# EAGLE design circuito_distanciamento_social (EAGLE 9.6.1)
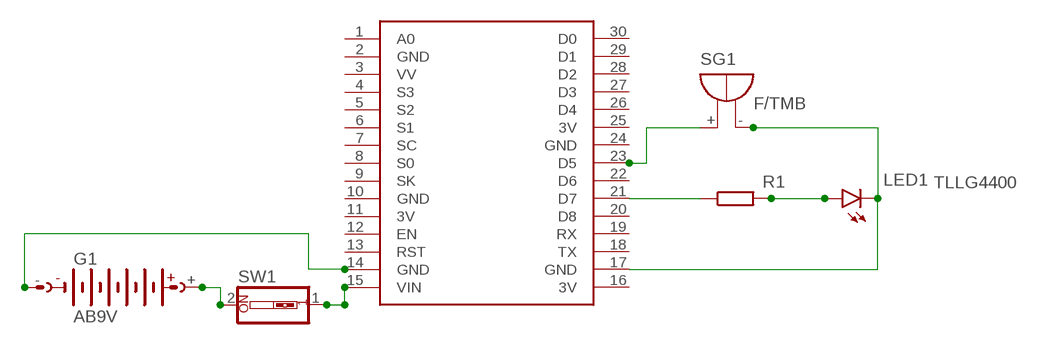
[diagram p0: schematic, sheet 1]

## Parts
G1  AB9V  [AB9V]
LED1  TLLG4400  [LED3MM]
R1  R-EU_0207/10  [0207/10]
SG1  F/TMB  [F/TMB]
SW1  SW_DIP-1  [EDG-01]
U$1  NODEMCU  [NODEMCU]

## Nets
N$1: R1.1 U$1.21(D7)
N$2: LED1.K(C) SG1.- U$1.17(GND)
N$4: SG1.+ U$1.23(D5)
N$9: LED1.A R1.2
N$15: G1.+ SW1.2
N$17: G1.- U$1.14(GND)
N$18: SW1.1 U$1.15(VIN)
Unconnected: U$1.1(A0) U$1.3(VV) U$1.4(S3) U$1.5(S2) U$1.6(S1) U$1.7(SC) U$1.8(S0) U$1.9(SK) U$1.12(EN) U$1.13(RST) U$1.18(TX) U$1.19(RX) U$1.20(D8) U$1.22(D6) U$1.26(D4) U$1.27(D3) U$1.28(D2) U$1.29(D1) U$1.30(D0)

## Power pins joined to a net without a drawn wire
3V: U$1.11(3V) U$1.16(3V) U$1.25(3V)
GND: U$1.2(GND) U$1.10(GND) U$1.24(GND)

## Library data of the parts
G1 = battery:AB9V: 9-V BATTERY CLIP
LED1 = led:TLLG4400: Low Current (2mA) LED 3 mm Tinted Diffused Package color GREEN Source: Data sheet <http://www.farnell.com/datasheets/391098.pdf>; MF: VISHAY SEMICONDUCTOR; OC_FARNELL: 1612435
R1 = rcl:R-EU_: RESISTOR, European symbol; SPICEPREFIX: R
SG1 = buzzer:F/TMB: BUZZER Source: Buerklin; OC_FARNELL: unknown; OC_NEWARK: unknown
SW1 = special:SW_DIP-1: DIP SWITCH
U$1 = nodemcu:NODEMCU

## Board
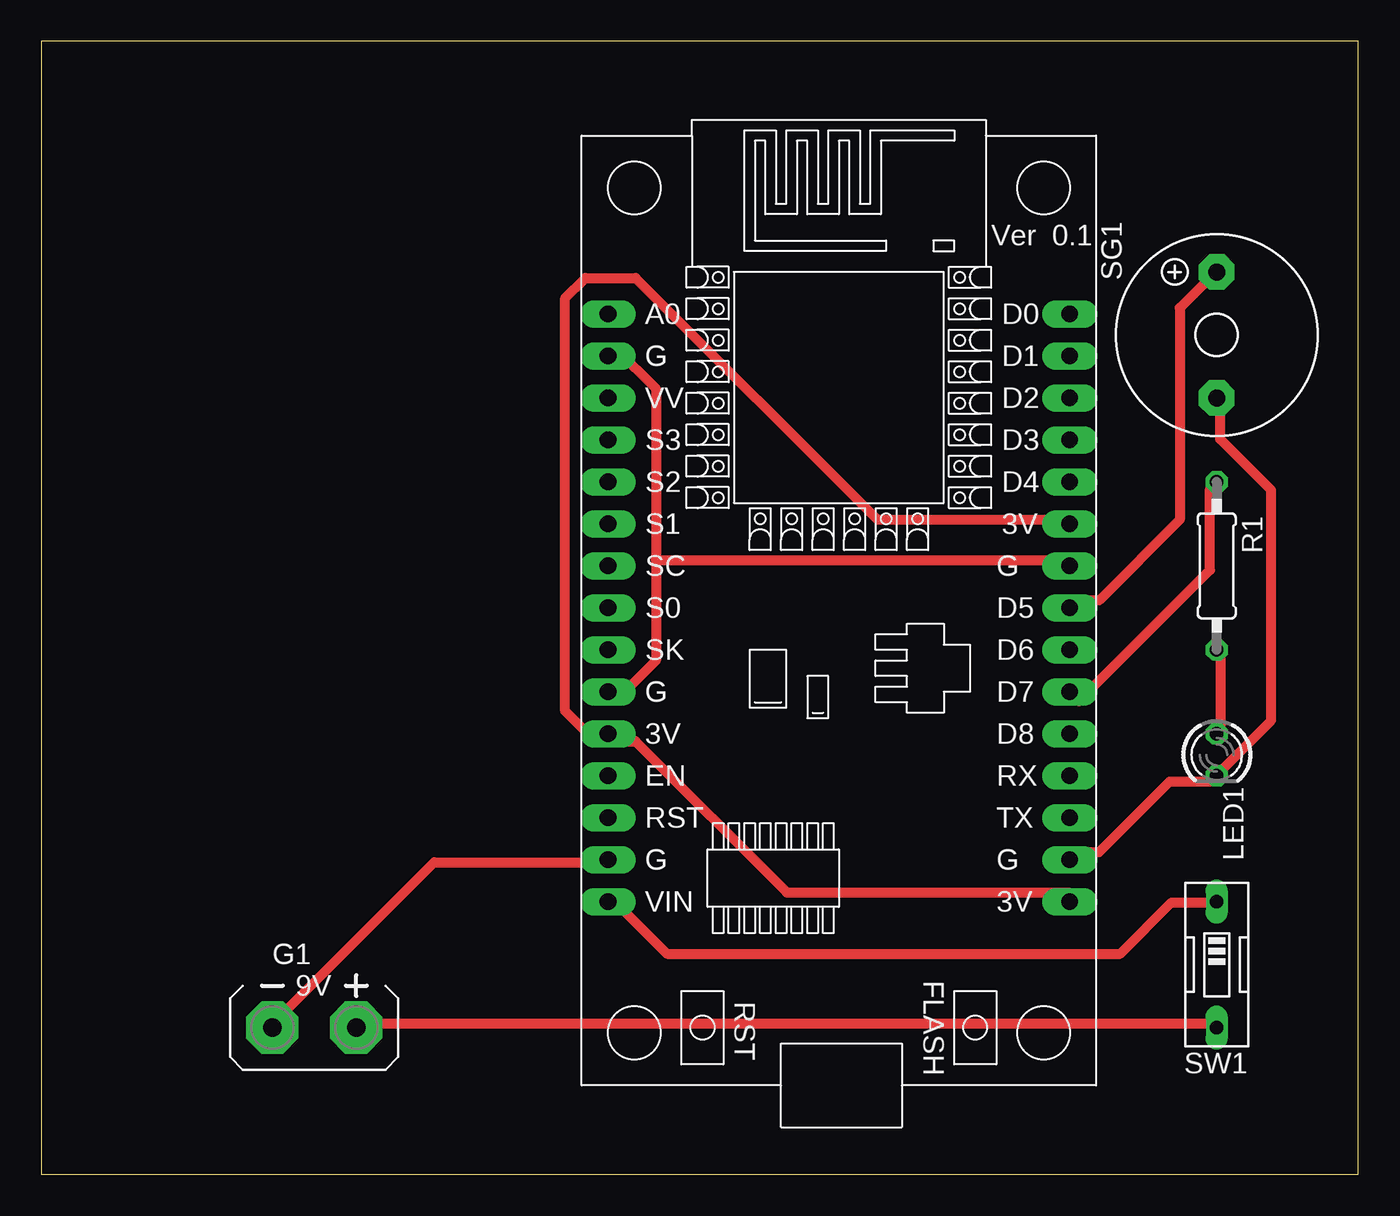
[diagram p1: board, top side]

Size 79.68 x 68.57 mm. Coordinates in mm from the lower left corner, seen from the top.
Outline: 0,0 79.68,0 79.68,68.57 0,68.57 0,0
Copper layers (1*16): Top 0.035mm / dielectric 1.5mm / Bottom 0.035mm
Design rules "default *": minimum track width 24mil, minimum drill 0.35mm, track to track 24mil, track to pad 24mil, pad to pad 24mil, via to via 24mil, smd to smd 6mil, copper to edge 40mil, drill to drill 24mil, minimum pad ring 10mil, minimum via ring 8mil, stop-mask expansion 4mil, vias tented up to drill 0mil, thermal gap 10mil

### Footprints (pad centres in the part's own frame; a part is rotated, then mirrored left to right if it is on the bottom)
AB9V = drill 1.118 pad 3.15 octagon: + 0,2.54; - 0,-2.54
LED3MM = drill 0.813 octagon: A -1.27,0; K 1.27,0
0207/10 = drill 0.813 octagon: 1 -5.08,0; 2 5.08,0
F/TMB = drill 1.016 pad 2.159 octagon: + 3.81,0; - -3.81,0
EDG-01 = drill 0.813 long: 1 0,-3.81; 2 0,3.81
NODEMCU = drill 1 pad 1.676 long: 1 -13.97,17.78; 2 -13.97,15.24; 3 -13.97,12.7; 4 -13.97,10.16; 5 -13.97,7.62; 6 -13.97,5.08; 7 -13.97,2.54; 8 -13.97,0; 9 -13.97,-2.54; 10 -13.97,-5.08; 11 -13.97,-7.62; 12 -13.97,-10.16; 13 -13.97,-12.7; 14 -13.97,-15.24; 15 -13.97,-17.78; 16 13.97,-17.78; 17 13.97,-15.24; 18 13.97,-12.7; 19 13.97,-10.16; 20 13.97,-7.62; 21 13.97,-5.08; 22 13.97,-2.54; 23 13.97,0; 24 13.97,2.54; 25 13.97,5.08; 26 13.97,7.62; 27 13.97,10.16; 28 13.97,12.7; 29 13.97,15.24; 30 13.97,17.78

### Placement (x,y rotation side)
G1  16.51,8.89 270 top
LED1  71.12,25.4 270 top
R1  71.12,36.83 270 top
SG1  71.12,50.8 90 top
SW1  71.12,12.7 180 top
U$1  48.26,34.29 0 top

### Tracks (layer width: path | path; a pad name or v marks a point on that pad's centre or on a via)
3V
  Top 0.61: U$1.16 62.18,17.07 45.11,17.07 35.97,26.21 34.75,26.21 U$1.11 34.14,26.82 32.92,26.82 31.7,28.04 31.7,53.03 32.92,54.25 35.97,54.25 50.6,39.62 62.18,39.62 U$1.25
GND
  Top 0.61: 37.19,37.19 37.19,47.55 34.75,49.99 U$1.2 | 37.19,37.19 37.19,31.09 35.36,29.26 34.75,29.26 U$1.10 | 37.19,37.19 62.18,37.19 U$1.24
N$1
  Top 0.61: R1.1 70.71,41.45 70.71,36.58 62.79,28.65 U$1.21
N$2
  Top 0.61: U$1.17 62.79,19.51 64.01,19.51 68.28,23.77 70.71,23.77 LED1.K 71.32,24.38 74.42,27.48 74.42,41.4 71.32,44.5 71.32,46.94 SG1.-
N$4
  Top 0.61: U$1.23 62.79,34.75 64.01,34.75 68.89,39.62 68.89,52.43 70.71,54.25 SG1.+
N$9
  Top 0.61: LED1.A 71.32,26.82 71.32,31.7 R1.2
N$15
  Top 0.61: SW1.2 70.71,9.14 19.51,9.14 G1.+
N$17
  Top 0.61: U$1.14 34.14,18.9 23.77,18.9 14.02,9.14 G1.-
N$18
  Top 0.61: SW1.1 70.71,16.46 68.38,16.46 65.28,13.36 37.85,13.36 34.75,16.46 U$1.15